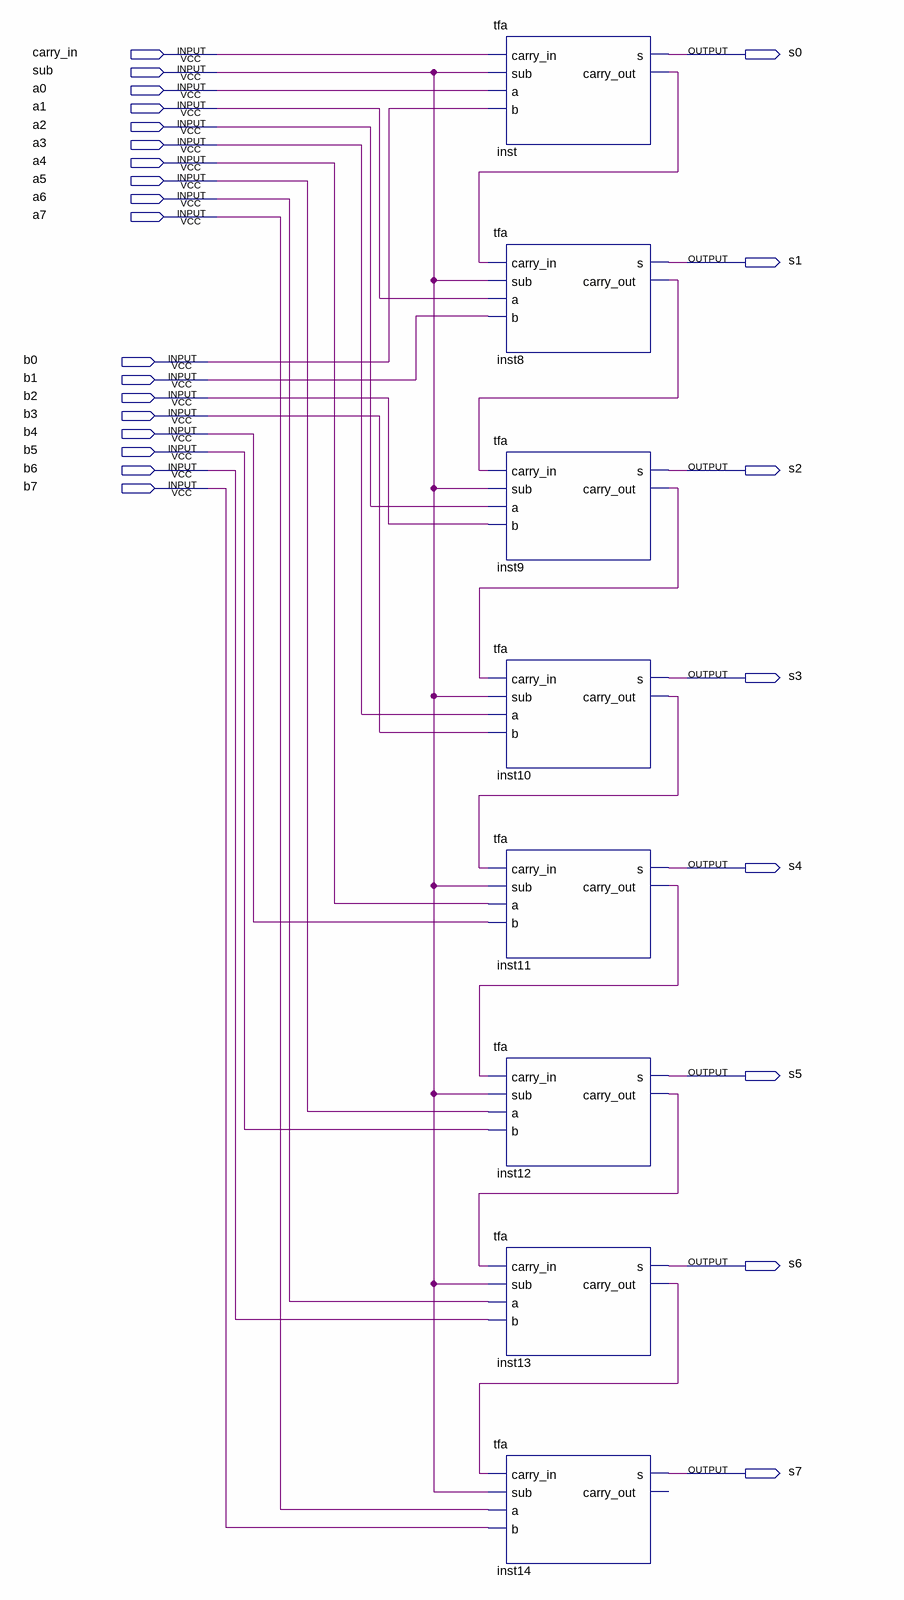
[diagram p0: schematic sheet]
// Quartus schematic jje.bdf as structural Verilog: 8 symbols, 26 pins
module jje (
  input  carry_in,
  input  sub,
  input  a0,
  input  a1,
  input  a2,
  input  a3,
  input  a4,
  input  a5,
  input  a6,
  input  a7,
  input  b0,
  input  b1,
  input  b2,
  input  b3,
  input  b4,
  input  b5,
  input  b6,
  input  b7,
  output s0,
  output s1,
  output s2,
  output s3,
  output s4,
  output s5,
  output s6,
  output s7
);

  wire inst8_carry_out, inst9_carry_out, inst10_carry_out, inst11_carry_out, inst12_carry_out,
       inst13_carry_out, inst_carry_out;

  tfa inst (.carry_in(carry_in), .sub(sub), .a(a0), .b(b0), .s(s0), .carry_out(inst_carry_out));
  tfa inst8 (.carry_in(inst_carry_out), .sub(sub), .a(a1), .b(b1), .s(s1), .carry_out(inst8_carry_out));
  tfa inst9 (.carry_in(inst8_carry_out), .sub(sub), .a(a2), .b(b2), .s(s2), .carry_out(inst9_carry_out));
  tfa inst10 (.carry_in(inst9_carry_out), .sub(sub), .a(a3), .b(b3), .s(s3), .carry_out(inst10_carry_out));
  tfa inst11 (.carry_in(inst10_carry_out), .sub(sub), .a(a4), .b(b4), .s(s4), .carry_out(inst11_carry_out));
  tfa inst12 (.carry_in(inst11_carry_out), .sub(sub), .a(a5), .b(b5), .s(s5), .carry_out(inst12_carry_out));
  tfa inst13 (.carry_in(inst12_carry_out), .sub(sub), .a(a6), .b(b6), .s(s6), .carry_out(inst13_carry_out));
  tfa inst14 (.carry_in(inst13_carry_out), .sub(sub), .a(a7), .b(b7), .s(s7));  // open: carry_out
endmodule
